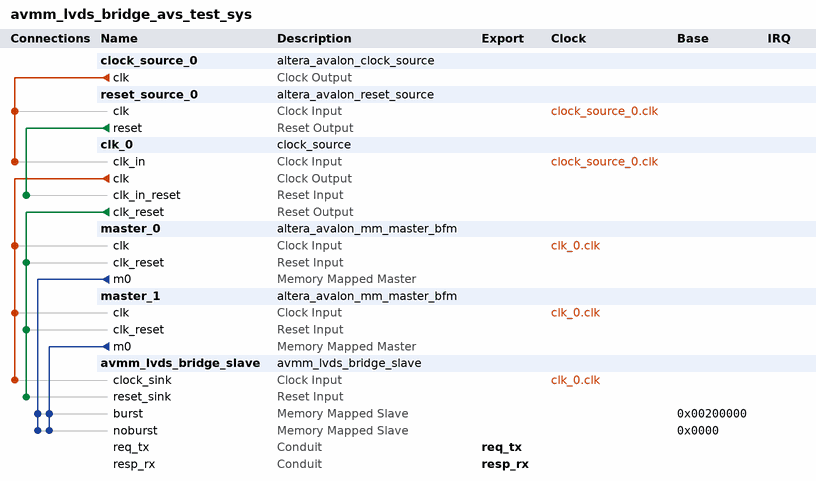
[diagram p0: system contents]
# Platform Designer (Qsys) system avmm_lvds_bridge_avs_test_sys, Cyclone V 5CEBA2F17A7
# Parameters at their usual value, and those the tool derives, are not listed.
package require -exact qsys 15.1
create_system avmm_lvds_bridge_avs_test_sys
set_project_property DEVICE_FAMILY {Cyclone V}
set_project_property DEVICE 5CEBA2F17A7

add_instance clock_source_0 altera_avalon_clock_source 15.1
set_instance_parameter_value clock_source_0 CLOCK_RATE 100
set_instance_parameter_value clock_source_0 CLOCK_UNIT 1000000

add_instance reset_source_0 altera_avalon_reset_source 15.1
set_instance_parameter_value reset_source_0 ASSERT_HIGH_RESET 1
set_instance_parameter_value reset_source_0 INITIAL_RESET_CYCLES 3

add_instance clk_0 clock_source 15.1
set_instance_parameter_value clk_0 clockFrequency 100000000

add_instance master_0 altera_avalon_mm_master_bfm 15.1
set_instance_parameter_value master_0 ADDRESS_UNITS SYMBOLS
set_instance_parameter_value master_0 AV_ADDRESS_W 32
set_instance_parameter_value master_0 AV_ALWAYS_BURST_MAX_BURST 0
set_instance_parameter_value master_0 AV_BURSTCOUNT_W 11
set_instance_parameter_value master_0 AV_BURST_BNDR_ONLY 1
set_instance_parameter_value master_0 AV_BURST_LINEWRAP 1
set_instance_parameter_value master_0 AV_CONSTANT_BURST_BEHAVIOR 1
set_instance_parameter_value master_0 AV_FIX_READ_LATENCY 1
set_instance_parameter_value master_0 AV_MAX_PENDING_WRITES 0
set_instance_parameter_value master_0 AV_NUMSYMBOLS 4
set_instance_parameter_value master_0 AV_READRESPONSE_W 8
set_instance_parameter_value master_0 AV_READ_WAIT_TIME 1
set_instance_parameter_value master_0 AV_WRITERESPONSE_W 8
set_instance_parameter_value master_0 USE_BURSTCOUNT 1
set_instance_parameter_value master_0 USE_BYTE_ENABLE 1
set_instance_parameter_value master_0 USE_READ 1
set_instance_parameter_value master_0 USE_READ_DATA 1
set_instance_parameter_value master_0 USE_READ_DATA_VALID 1
set_instance_parameter_value master_0 USE_WAIT_REQUEST 1
set_instance_parameter_value master_0 VHDL_ID 0

add_instance master_1 altera_avalon_mm_master_bfm 15.1
set_instance_parameter_value master_1 ADDRESS_UNITS SYMBOLS
set_instance_parameter_value master_1 AV_ADDRESS_W 32
set_instance_parameter_value master_1 AV_ALWAYS_BURST_MAX_BURST 0
set_instance_parameter_value master_1 AV_BURSTCOUNT_W 11
set_instance_parameter_value master_1 AV_BURST_BNDR_ONLY 1
set_instance_parameter_value master_1 AV_BURST_LINEWRAP 1
set_instance_parameter_value master_1 AV_CONSTANT_BURST_BEHAVIOR 1
set_instance_parameter_value master_1 AV_FIX_READ_LATENCY 1
set_instance_parameter_value master_1 AV_MAX_PENDING_WRITES 0
set_instance_parameter_value master_1 AV_NUMSYMBOLS 4
set_instance_parameter_value master_1 AV_READRESPONSE_W 8
set_instance_parameter_value master_1 AV_READ_WAIT_TIME 1
set_instance_parameter_value master_1 AV_WRITERESPONSE_W 8
set_instance_parameter_value master_1 USE_BURSTCOUNT 1
set_instance_parameter_value master_1 USE_BYTE_ENABLE 1
set_instance_parameter_value master_1 USE_READ 1
set_instance_parameter_value master_1 USE_READ_DATA 1
set_instance_parameter_value master_1 USE_READ_DATA_VALID 1
set_instance_parameter_value master_1 USE_WAIT_REQUEST 1
set_instance_parameter_value master_1 VHDL_ID 0

add_instance avmm_lvds_bridge_slave avmm_lvds_bridge_slave 1.0
set_instance_parameter_value avmm_lvds_bridge_slave ADDR_W 19
set_instance_parameter_value avmm_lvds_bridge_slave BURSTCNT_W 11
set_instance_parameter_value avmm_lvds_bridge_slave REQ_FACTOR 1
set_instance_parameter_value avmm_lvds_bridge_slave RESP_FACTOR 1

# connections
add_connection clk_0.clk avmm_lvds_bridge_slave.clock_sink clock
add_connection clk_0.clk master_0.clk clock
add_connection clk_0.clk master_1.clk clock
add_connection clock_source_0.clk clk_0.clk_in clock
add_connection clock_source_0.clk reset_source_0.clk clock
add_connection clk_0.clk_reset avmm_lvds_bridge_slave.reset_sink reset
add_connection clk_0.clk_reset master_0.clk_reset reset
add_connection clk_0.clk_reset master_1.clk_reset reset
add_connection reset_source_0.reset clk_0.clk_in_reset reset
add_connection master_0.m0 avmm_lvds_bridge_slave.burst avalon
set_connection_parameter_value master_0.m0/avmm_lvds_bridge_slave.burst baseAddress 0x00200000
add_connection master_0.m0 avmm_lvds_bridge_slave.noburst avalon
set_connection_parameter_value master_0.m0/avmm_lvds_bridge_slave.noburst baseAddress 0x0000
add_connection master_1.m0 avmm_lvds_bridge_slave.burst avalon
set_connection_parameter_value master_1.m0/avmm_lvds_bridge_slave.burst baseAddress 0x00200000
add_connection master_1.m0 avmm_lvds_bridge_slave.noburst avalon
set_connection_parameter_value master_1.m0/avmm_lvds_bridge_slave.noburst baseAddress 0x0000

# exported interfaces
add_interface req_tx conduit end
set_interface_property req_tx EXPORT_OF avmm_lvds_bridge_slave.req_tx
add_interface resp_rx conduit end
set_interface_property resp_rx EXPORT_OF avmm_lvds_bridge_slave.resp_rx

set_interconnect_requirement {$system} qsys_mm.clockCrossingAdapter HANDSHAKE
set_interconnect_requirement {$system} qsys_mm.enableEccProtection FALSE
set_interconnect_requirement {$system} qsys_mm.insertDefaultSlave FALSE
set_interconnect_requirement {$system} qsys_mm.maxAdditionalLatency 1

save_system avmm_lvds_bridge_avs_test_sys.qsys
